# EAGLE design SparkFun_USB_RS485_Converter (EAGLE 7.2.0)
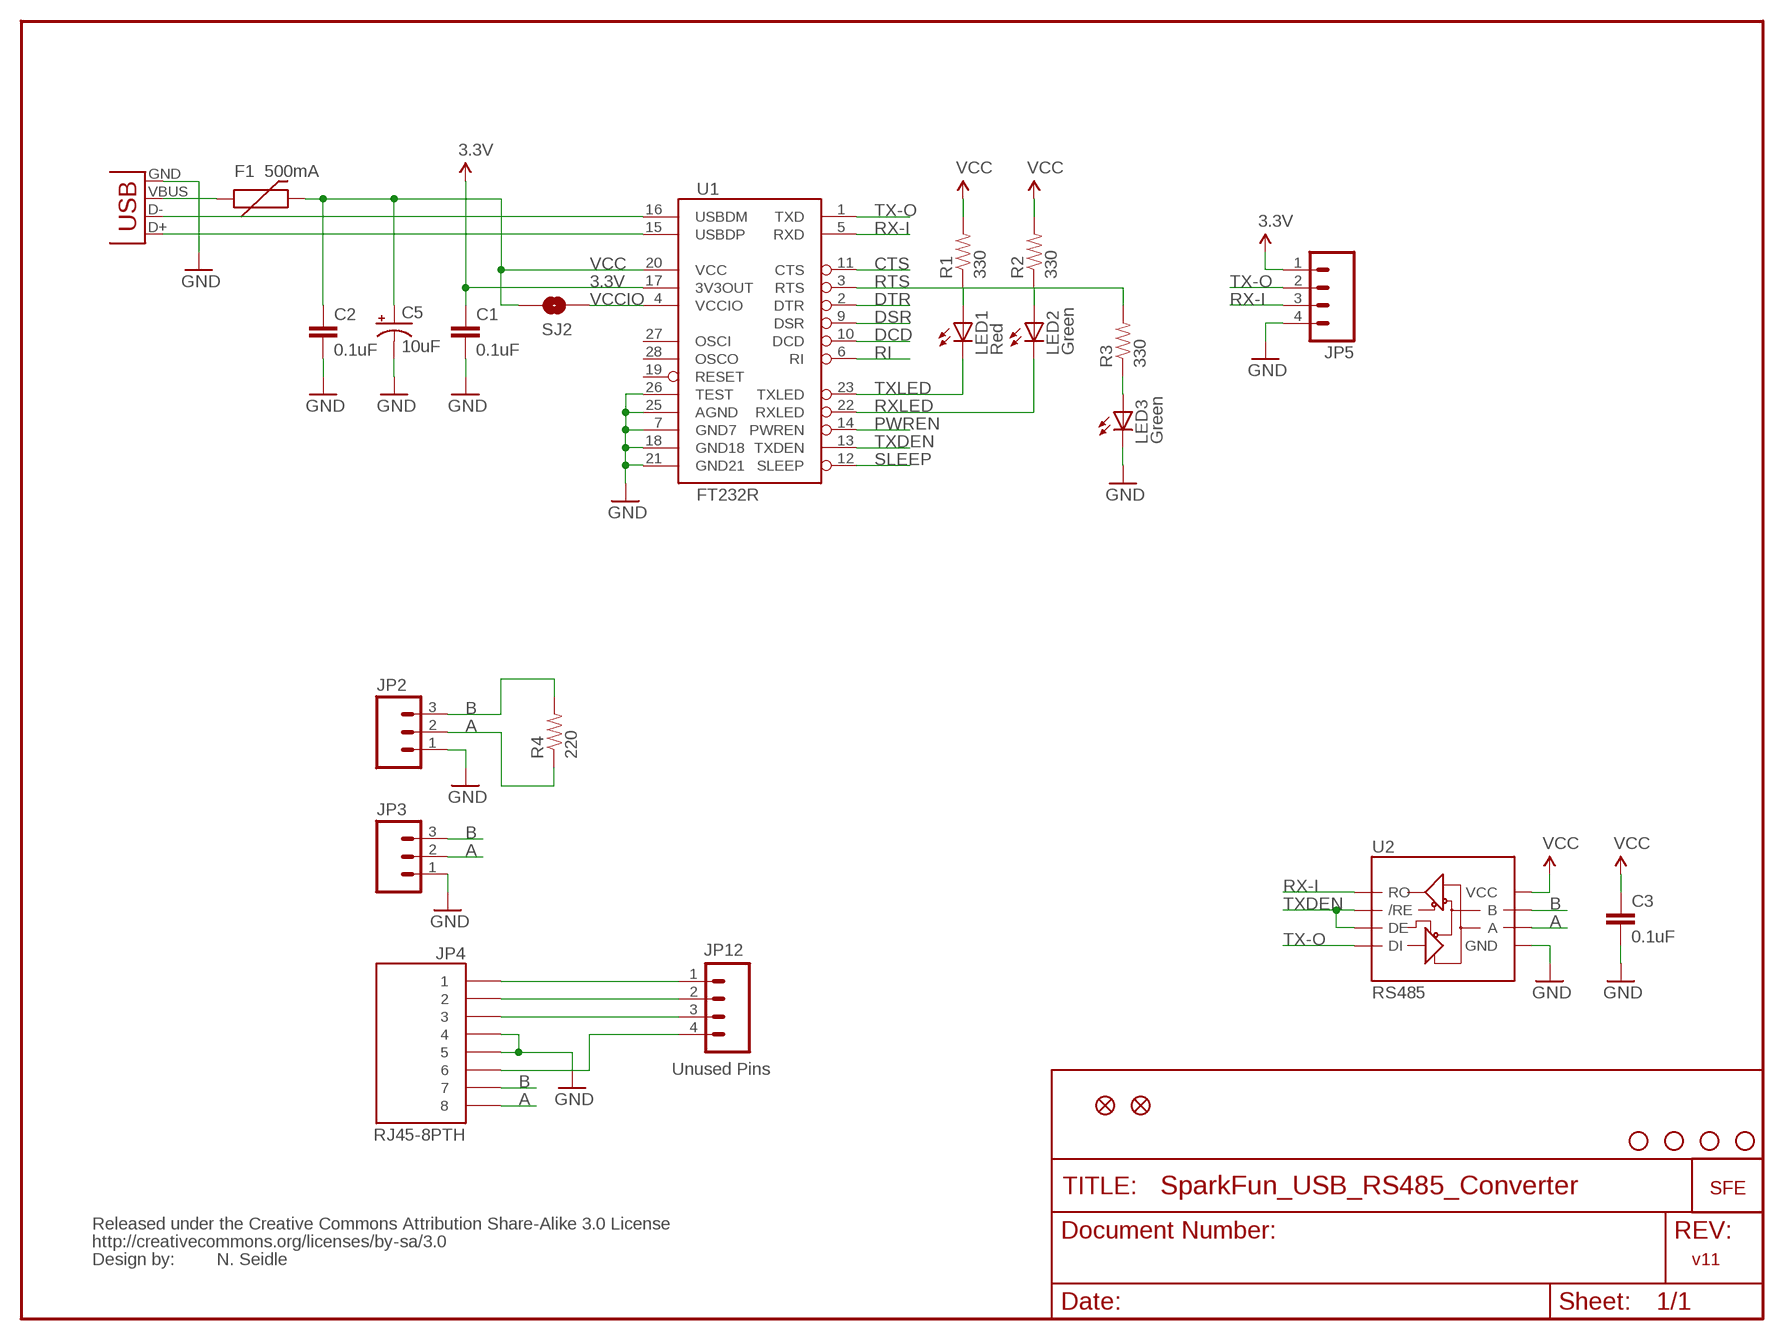
[diagram p0: schematic, sheet 1]

## Parts
C1  0.1uF  CAP0402-CAP  [0402-CAP]
C2  0.1uF  CAP0402-CAP  [0402-CAP]
C3  0.1uF  CAP0402-CAP  [0402-CAP]
C5  10uF  CAP_POL1206  [EIA3216]
F1  500mA  PTCSMD  [PTC-1206]
JP1  STAND-OFF  [STAND-OFF]
JP2  M03SCREW  [SCREWTERMINAL-3.5MM-3]
JP3  M03PTH  [1X03]
JP4  RJ45-8PTH  [RJ45-8]
JP5  M04PTH  [1X04]
JP6  STAND-OFF  [STAND-OFF]
JP7  STAND-OFF  [STAND-OFF]
JP8  STAND-OFF  [STAND-OFF]
JP9  FIDUCIAL1X2  [FIDUCIAL-1X2]
JP10  FIDUCIAL1X2  [FIDUCIAL-1X2]
JP12  Unused Pins  M04PTH  [1X04]
LED1  Red  LED0603  [LED-0603]
LED2  Green  LED0603  [LED-0603]
LED3  Green  LED0603  [LED-0603]
R1  330  RESISTOR0402-RES  [0402-RES]
R2  330  RESISTOR0402-RES  [0402-RES]
R3  330  RESISTOR0402-RES  [0402-RES]
R4  220  RESISTOR0402-RES  [0402-RES]
SJ2  SOLDERJUMPERNC2  [SJ_2S-NOTRACE]
U1  FT232R  FT232RLSSOP  [SSOP28DB]
U2  RS485  RS485SOIC  [SO08]
U$1  CREATIVE_COMMONS  [CREATIVE_COMMONS]
U$2  LOGO-SFENEW  [SFE-NEW-WEBLOGO]
X2  USBSMD  [USB-MINIB]

## Nets
3.3V [power]: C1.1 JP5.1 U1.17(3V3OUT)
A: JP2.2 JP3.2 JP4.8 R4.1 U2.6(A)
B: JP2.3 JP3.3 JP4.7 R4.2 U2.7(B)
CTS: U1.11(CTS)
DCD: U1.10(DCD)
DSR: U1.9(DSR)
DTR: U1.2(DTR)
GND [power]: C1.2 C2.2 C3.2 C5.C(-) JP2.1 JP3.1 JP4.4 JP4.5 JP5.4 LED3.C U1.7(GND7) U1.18(GND18) U1.21(GND21) U1.25(AGND) U1.26(TEST) U2.5(GND) X2.GND
N$1: LED1.A R1.1
N$2: LED2.A R2.1
N$3: F1.1 X2.VBUS
N$4: LED3.A R3.1
N$5: JP4.1 JP12.1
N$6: JP4.2 JP12.2
N$7: JP4.3 JP12.3
N$8: JP4.6 JP12.4
PWREN: U1.14(PWREN)
RI: U1.6(RI)
RTS: R3.2 U1.3(RTS)
RX-I: JP5.3 U1.5(RXD) U2.1(RO)
RXLED: LED2.C U1.22(RXLED)
SLEEP: U1.12(SLEEP)
TX-O: JP5.2 U1.1(TXD) U2.4(DI)
TXDEN: U1.13(TXDEN) U2.2(/RE) U2.3(DE)
TXLED: LED1.C U1.23(TXLED)
USB_D+: U1.15(USBDP) X2.D+
USB_D-: U1.16(USBDM) X2.D-
VCC [power]: C2.1 C3.1 C5.A(+) F1.2 R1.2 R2.2 SJ2.2 U1.20(VCC) U2.8(VCC)
VCCIO: SJ2.1 U1.4(VCCIO)
Unconnected: U1.19(RESET) U1.27(OSCI) U1.28(OSCO)

## Notes on the sheet
- N. Seidle | v11

## Library data of the parts
C1-C3 = SparkFun:CAP: Capacitor Standard 0603 ceramic capacitor, and 0.1" leaded capacitor.
C5 = SparkFun:CAP_POL: Capacitor Polarized These are standard SMD and PTH capacitors. Normally 10uF, 47uF, and 100uF in electrolytic and tantalum varieties. Always verify the external diameter of the through hole cap, it varies with capacity, voltage, and manufacturer. The EIA devices should be standard.
F1 = SparkFun:PTC: Resettable Fuse PTC Resettable Fuse. Spark Fun Electronics SKU : COM-08357
JP1 JP6-JP8 = SparkFun:STAND-OFF: Stand Off This is the mechanical footprint for a #4 phillips button head screw. Use the keepout ring to avoid running the screw head into surrounding components. SKU : PRT-00447
JP2 JP3 = SparkFun:M03: Header 3 Standard 3-pin 0.1" header. Use with straight break away headers (SKU : PRT-00116), right angle break away headers (PRT-00553), swiss pins (PRT-00743), machine pins (PRT-00117), and female headers (PRT-00115). Molex polarized connector foot print use with SKU : PRT-08232 with associated crimp pins and housings.
JP4 = SparkFun:RJ45-8: RJ45 Jack Simple RJ45, 8-pin connection - connector for common Cat5, Cat5e, and Cat6 Ethernet cables. Footprint not yet proven in production. Connector sku is PRT-00643; Breakout PCB sku is BOB-00716.
JP5 JP12 = SparkFun:M04: Header 4 Standard 4-pin 0.1" header. Use with straight break away headers (SKU : PRT-00116), right angle break away headers (PRT-00553), swiss pins (PRT-00743), machine pins (PRT-00117), and female headers (PRT-00115). Molex polarized connector foot print use with SKU : PRT-08231 with associated crimp pins and housings.
JP9 JP10 = SparkFun:FIDUCIAL: Fiducial Alignment Points Various fiducial points for machine vision alignment.
LED1-LED3 = SparkFun:LED: LEDs Standard schematic elements and footprints for 5mm, 3mm, 1206, and 0603 sized LEDs. 5mm - Spark Fun Electronics SKU : COM-00529 (and others)
R1-R4 = SparkFun:RESISTOR: Resistor Basic schematic elements and footprints for 0603, 1206, and PTH 1/10th watt (small) resistors.
SJ2 = SparkFun:SOLDERJUMPER: Solder Jumper Standard SMD solder jumper. Used to automate production. Two varients : Normally Open and Normally Closed are the same, but have different paste layers. NC will have a large amount of paste and should jumper during reflow.
U1 = SparkFun:FT232RL: USB UART FT232RL 4th Generation USB UART (USB <-> Serial) Controller. Spark Fun Electronics SKU : COM-00650
U2 = SparkFun:RS485
U$1 = SparkFun:CREATIVE_COMMONS
U$2 = SparkFun:LOGO-SFE: Spark Fun Electronics PCB Logo This is the standard Spark Fun Electronics PCB logo.
X2 = SparkFun:USB: USB Connectors USB-B-PTH is fully proven SKU : PRT-00139 USB-miniB is fully proven SKU : PRT-00587 USB-A-PCB is untested. USB-A-H is throughly reviewed, but untested. Spark Fun Electronics SKU : PRT-00437 USB-B-SMT is throughly reviewed, but untested. Needs silkscreen touching up. USB-A-S has not been used/tested USB-MB-H has not been used/tested

## Net classes
0 default: width 0.203 mm
1 power: width 0.254 mm

## Board
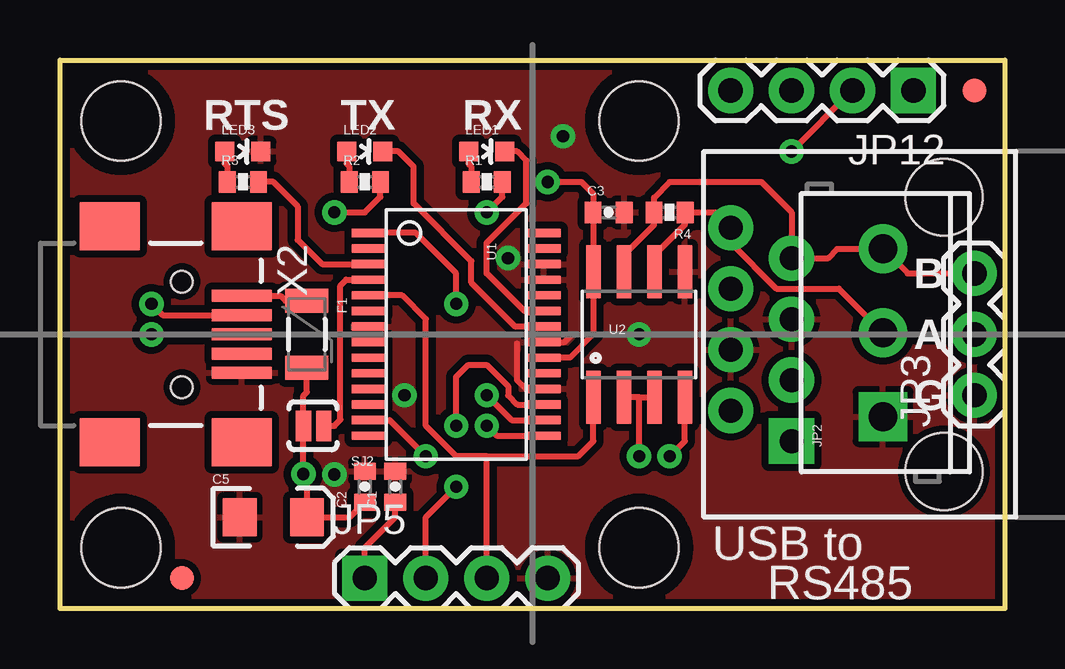
[diagram p1: board, top side]
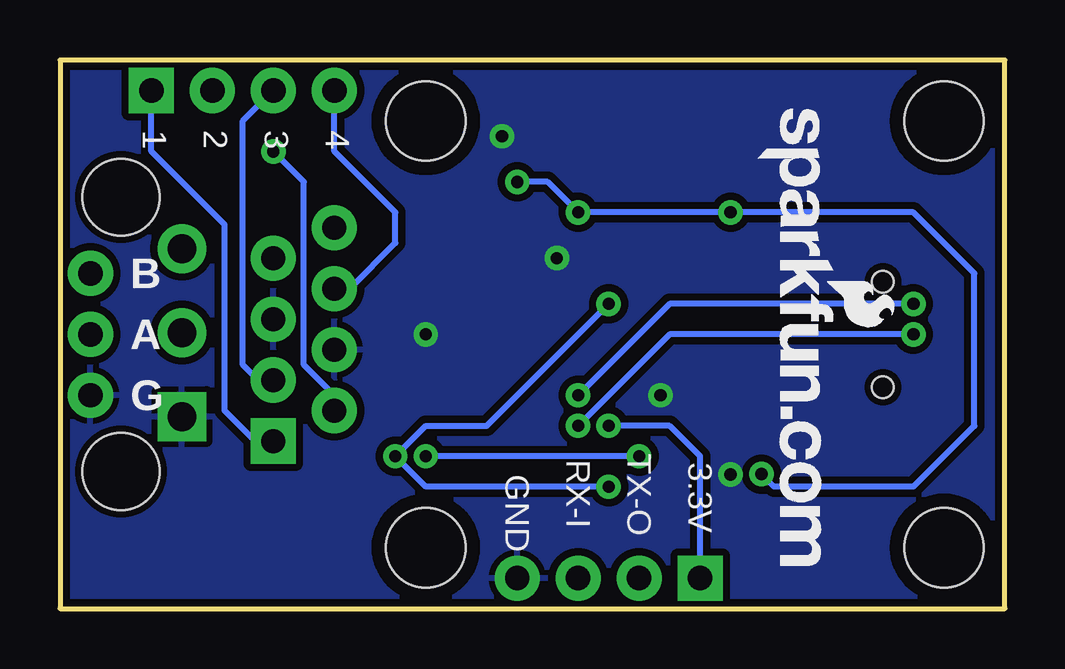
[diagram p2: board, bottom side, seen from below]

Size 39.37 x 22.86 mm. Coordinates in mm from the lower left corner, seen from the top.
Outline: 39.37,0 0,0 0,22.86 39.37,22.86 39.37,0
Copper layers (1*16): Top 0.035mm / dielectric 1.5mm / Bottom 0.035mm
Design rules "SparkFun": minimum track width 8mil, minimum drill 20mil, track to track 8mil, track to pad 8mil, pad to pad 8mil, via to via 8mil, smd to smd 8mil, copper to edge 8mil, drill to drill 8mil, minimum pad ring 12mil, minimum via ring 10mil, stop-mask expansion 4mil, vias tented up to drill 20mil, thermal gap 10mil

### Footprints (pad centres in the part's own frame; a part is rotated, then mirrored left to right if it is on the bottom)
0402-CAP = smd 0.7 x 0.9: 1 -0.65,0; 2 0.65,0
EIA3216 = smd 1.4 x 1.6: A 1.4,0; C -1.4,0
PTC-1206 = smd 1 x 1.8: 1 -1.4,0; 2 1.4,0
STAND-OFF = hole 3.302: 0,0
SCREWTERMINAL-3.5MM-3 = drill 1.2 pad 2.032 square: 1 0,0 | drill 1.2 pad 2.032: 2 3.5,0; 3 7,0
1X03 = drill 1.016 pad 1.88: 1 0,0; 2 2.54,0; 3 5.08,0
RJ45-8 = drill 1 pad 1.88 square: 1 -4.445,6.35 | drill 1 pad 1.88: 2 -3.175,8.89; 3 -1.905,6.35; 4 -0.635,8.89; 5 0.635,6.35; 6 1.905,8.89; 7 3.175,6.35; 8 4.445,8.89 | hole 3.2: -5.715,0; 5.715,0
1X04 = drill 1.016 pad 1.88 square: 1 0,0 | drill 1.016 pad 1.88: 2 2.54,0; 3 5.08,0; 4 7.62,0
FIDUCIAL-1X2 = smd 1 x 1: 1 0,0
LED-0603 = smd 0.8 x 0.8: A 0,-0.75; C 0,0.75
0402-RES = smd 0.7 x 0.9: 1 -0.65,0; 2 0.65,0
SJ_2S-NOTRACE = smd 0.635 x 1.27: 1 -0.45,0; 2 0.4,0
SSOP28DB = smd 0.348 x 1.397: 1 -4.225,-3.656; 2 -3.575,-3.656; 3 -2.925,-3.656; 4 -2.275,-3.656; 5 -1.625,-3.656; 6 -0.975,-3.656; 7 -0.325,-3.656; 8 0.325,-3.656; 9 0.975,-3.656; 10 1.625,-3.656; 11 2.275,-3.656; 12 2.925,-3.656; 13 3.575,-3.656; 14 4.225,-3.656; 15 4.225,3.656; 16 3.575,3.656; 17 2.925,3.656; 18 2.275,3.656; 19 1.625,3.656; 20 0.975,3.656; 21 0.325,3.656; 22 -0.325,3.656; 23 -0.975,3.656; 24 -1.625,3.656; 25 -2.275,3.656; 26 -2.925,3.656; 27 -3.575,3.656; 28 -4.225,3.656
SO08 = smd 0.61 x 2.21: 1 -1.905,-2.616; 2 -0.635,-2.616; 3 0.635,-2.616; 4 1.905,-2.616; 5 1.905,2.616; 6 0.635,2.616; 7 -0.635,2.616; 8 -1.905,2.616
USB-MINIB = smd 2.5 x 0.5: D+ 2.5,0; D- 2.5,0.8; GND 2.5,-1.6; ID 2.5,-0.8; VBUS 2.5,1.6 | smd 2.5 x 2: GND@1 -3,-4.5; GND@2 -3,4.5; GND@3 2.5,4.5; GND@4 2.5,-4.5 | hole 0.9: 0,2.2; 0,-2.2

### Placement (x,y rotation side)
C1  13.97,5.08 90 top
C2  12.7,5.08 90 top
C3  22.86,16.51 0 top
C5  8.89,3.81 0 top
F1  10.29,11.43 270 top
JP1  2.54,20.32 0 top
JP2  34.29,8 90 top
JP3  38.1,8.89 90 top
JP4  36.83,11.43 90 top
JP5  12.7,1.27 0 top
JP6  2.54,2.54 0 top
JP7  24.13,20.32 0 top
JP8  24.13,2.54 0 top
JP9  5.08,1.27 0 top
JP10  38.1,21.59 0 top
JP12  35.56,21.59 180 top
LED1  17.78,19.05 270 top
LED2  12.7,19.05 270 top
LED3  7.62,19.05 270 top
R1  17.78,17.78 0 top
R2  12.7,17.78 0 top
R3  7.62,17.78 0 top
R4  25.4,16.51 180 top
SJ2  10.54,7.62 180 top
U1  16.51,11.43 270 top
U2  24.13,11.43 0 top
U$1  20.32,-8.89 0 top  (outside the outline)
U$2  10.29,20.83 270 bottom
X2  5.08,11.43 0 top

### Tracks (layer width: path | path; a pad name or v marks a point on that pad's centre or on a via)
3.3V  (via drill 0.51)
  Top 0.254: C1.1 13.97,3.81 12.7,2.54 JP5.1 | v16.51,7.62 16.51,9.65 17.02,10.16 17.78,10.16 18.67,9.27 18.67,8.89 19.05,8.51 U1.17
  Bottom 0.254: v16.51,7.62 13.97,7.62 12.7,6.35 JP5.1
A
  Top 0.254: JP3.2 34.36,11.43 JP2.2 32.46,13.34 29.84,13.34 27.94,15.24 JP4.8 27.3,16.51 R4.1 26.05,16.02 24.77,14.73 U2.6
B
  Top 0.254: JP3.3 35.32,13.97 JP2.3 34.27,14.99 32.38,14.99 32,14.61 JP4.7 30.48,16.51 29.21,17.78 25.4,17.78 24.75,17.13 R4.2 24.75,15.99 23.5,14.73 U2.7
GND  (via drill 0.51)
  Top 0.254: U1.21 21.01,11.11 21.34,11.43 | U1.18 19.42,9.15 19.05,9.53 19.05,11.05
  other vias: 18.67,14.61 11.43,5.59 24.13,11.43 20.95,19.68 14.35,8.89
  pour Bottom (isolate 0.305): 39.37,22.86 39.37,0 0,0 0,22.86
  pour Top (isolate 0.305): 39.37,22.86 39.37,0 0,0 0,22.86
N$1
  Top 0.254: R1.1 17.13,18.43 17.02,18.54 17.02,19.04 LED1.A
N$2
  Top 0.254: R2.1 12.05,18.43 11.94,18.54 11.94,19.04 LED2.A
N$3
  Top 0.254: X2.VBUS 9.2,13.03 9.4,12.83 10.54,12.83 F1.1
N$4
  Top 0.254: R3.1 6.97,18.43 6.86,18.54 6.86,19.04 LED3.A
N$5
  Bottom 0.254: JP4.1 31.24,6.99 32.51,8.26 32.51,16 35.56,19.05 JP12.1
N$6  (via drill 0.51)
  Top 0.254: v30.48,19.05 JP12.2
  Bottom 0.254: JP4.2 27.94,8.89 29.21,10.16 29.21,17.78 v30.48,19.05
N$7
  Bottom 0.254: JP4.3 31.11,9.53 31.75,10.16 31.75,20.32 JP12.3
N$8
  Bottom 0.254: JP4.6 27.3,13.34 25.4,15.24 25.4,16.51 27.94,19.05 JP12.4
RTS
  Top 0.254: U1.3 10.92,14.36 9.91,15.37 9.91,16.76 8.89,17.78 R3.2
RX-I
  Top 0.254: U2.1 22.23,6.99 21.59,6.35 17.78,6.35 | 17.78,6.35 16.51,6.35 15.24,7.62 15.24,12.06 14.25,13.05 U1.5 | JP5.3 17.78,6.35
RXLED
  Top 0.254: U1.22 18.98,11.76 17.14,13.59 17.14,14.48 14.73,16.89 14.73,18.41 14.1,19.05 LED2.C
TX-O  (via drill 0.51)
  Top 0.254: JP5.2 15.24,3.81 v16.51,5.08 | v16.51,12.7 16.51,13.97 14.82,15.65 U1.1 | U2.4 26.04,6.99 v25.4,6.35
  Bottom 0.254: v16.51,12.7 21.59,7.62 24.13,7.62 v25.4,6.35 24.13,5.08 v16.51,5.08
TXDEN  (via drill 0.51)
  Top 0.254: 24.13,8.81 U2.2 | 24.13,8.81 U2.3 | U1.13 13.73,7.86 v15.24,6.35 | v24.13,6.35 24.13,8.81
  Bottom 0.254: v15.24,6.35 v24.13,6.35
TXLED
  Top 0.254: U1.23 19.34,12.4 17.78,13.97 17.78,15.24 19.43,16.89 19.43,18.67 19.05,19.05 LED1.C
USB_D+  (via drill 0.51)
  Top 0.254: v3.81,11.43 X2.D+ | U1.15 18.2,7.21 v17.78,7.62
  Bottom 0.254: v3.81,11.43 13.97,11.43 v17.78,7.62
USB_D-  (via drill 0.51)
  Top 0.254: U1.16 18.82,7.86 v17.78,8.89 | X2.D- 4.28,12.23 v3.81,12.7
  Bottom 0.254: v17.78,8.89 13.97,12.7 v3.81,12.7
VCC  (via drill 0.51)
  Top 0.254: U1.20 21.25,10.46 22.23,11.43 U2.8 22.23,16.5 C3.1 22.21,17.29 21.72,17.78 v20.32,17.78 | R2.2 13.35,17.16 12.7,16.51 v11.43,16.51 | R1.2 18.43,17.16 v17.78,16.51 | C2.1 12.08,3.81 C5.A 10.29,5.46 v10.14,5.61 SJ2.2 10.14,8.87 10.29,9.02 F1.2
  Bottom 0.254: v10.14,5.61 9.61,5.08 3.81,5.08 1.27,7.62 1.27,13.97 3.81,16.51 v11.43,16.51 v17.78,16.51 19.05,17.78 v20.32,17.78
VCCIO
  Top 0.254: SJ2.1 11.43,7.62 11.68,7.87 11.68,13.46 11.93,13.71 U1.4

### Text on the board
tPlace: RTS | TX | RX | B | A | G | USB to | RS485 | N. Seidle
bPlace: 4 | 3 | 2 | 1 | B | A | G | 3.3V | TX-O | RX-I | GND